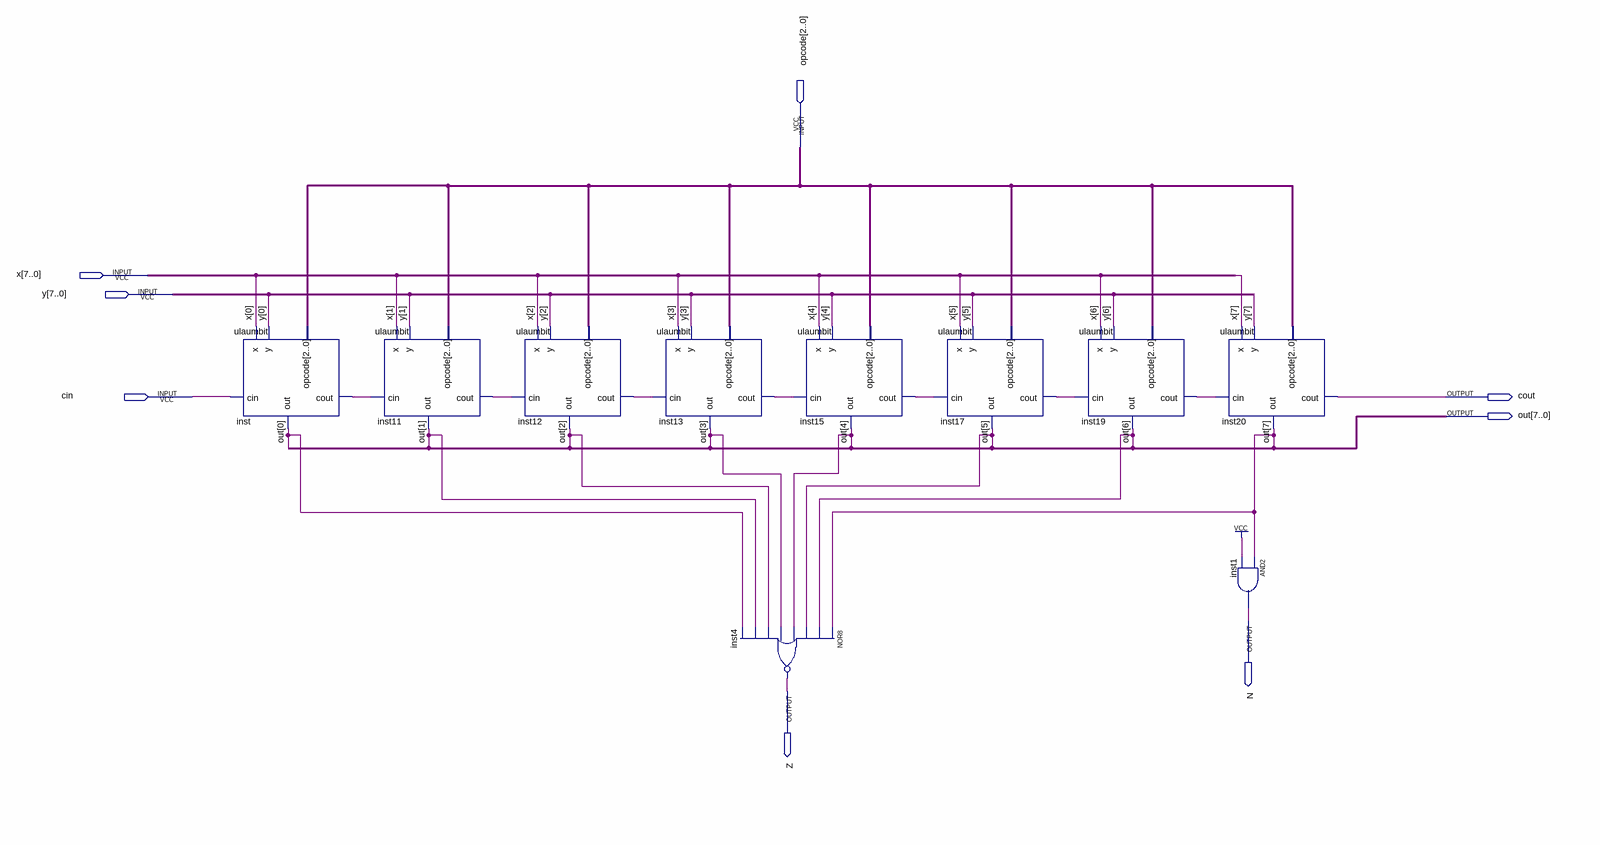
[diagram p0: schematic sheet]
// Quartus schematic ulaoitobits.bdf as structural Verilog: 10 symbols, 8 pins
module ulaoitobits (
  input  [2:0] opcode,
  input  [7:0] x,
  input  [7:0] y,
  input  cin,
  output cout,
  output [7:0] out,
  output N,
  output Z
);

  wire inst11_cout, inst12_cout, inst13_cout, inst15_cout, inst17_cout, inst19_cout, inst_cout;

  ulaumbit inst (.x(x[0]), .y(y[0]), .cin(cin), .opcode(opcode), .cout(inst_cout), .out(out[0]));
  ulaumbit inst11 (.x(x[1]), .y(y[1]), .cin(inst_cout), .opcode(opcode), .cout(inst11_cout), .out(out[1]));
  ulaumbit inst12 (.x(x[2]), .y(y[2]), .cin(inst11_cout), .opcode(opcode), .cout(inst12_cout), .out(out[2]));
  ulaumbit inst13 (.x(x[3]), .y(y[3]), .cin(inst12_cout), .opcode(opcode), .cout(inst13_cout), .out(out[3]));
  nor inst4 (Z, out[7], out[6], out[5], out[4], out[3], out[2], out[1], out[0]);
  ulaumbit inst15 (.x(x[4]), .y(y[4]), .cin(inst13_cout), .opcode(opcode), .cout(inst15_cout), .out(out[4]));
  ulaumbit inst17 (.x(x[5]), .y(y[5]), .cin(inst15_cout), .opcode(opcode), .cout(inst17_cout), .out(out[5]));
  ulaumbit inst19 (.x(x[6]), .y(y[6]), .cin(inst17_cout), .opcode(opcode), .cout(inst19_cout), .out(out[6]));
  ulaumbit inst20 (.x(x[7]), .y(y[7]), .cin(inst19_cout), .opcode(opcode), .cout(cout), .out(out[7]));
  and inst1 (N, out[7], 1'b1);
endmodule
